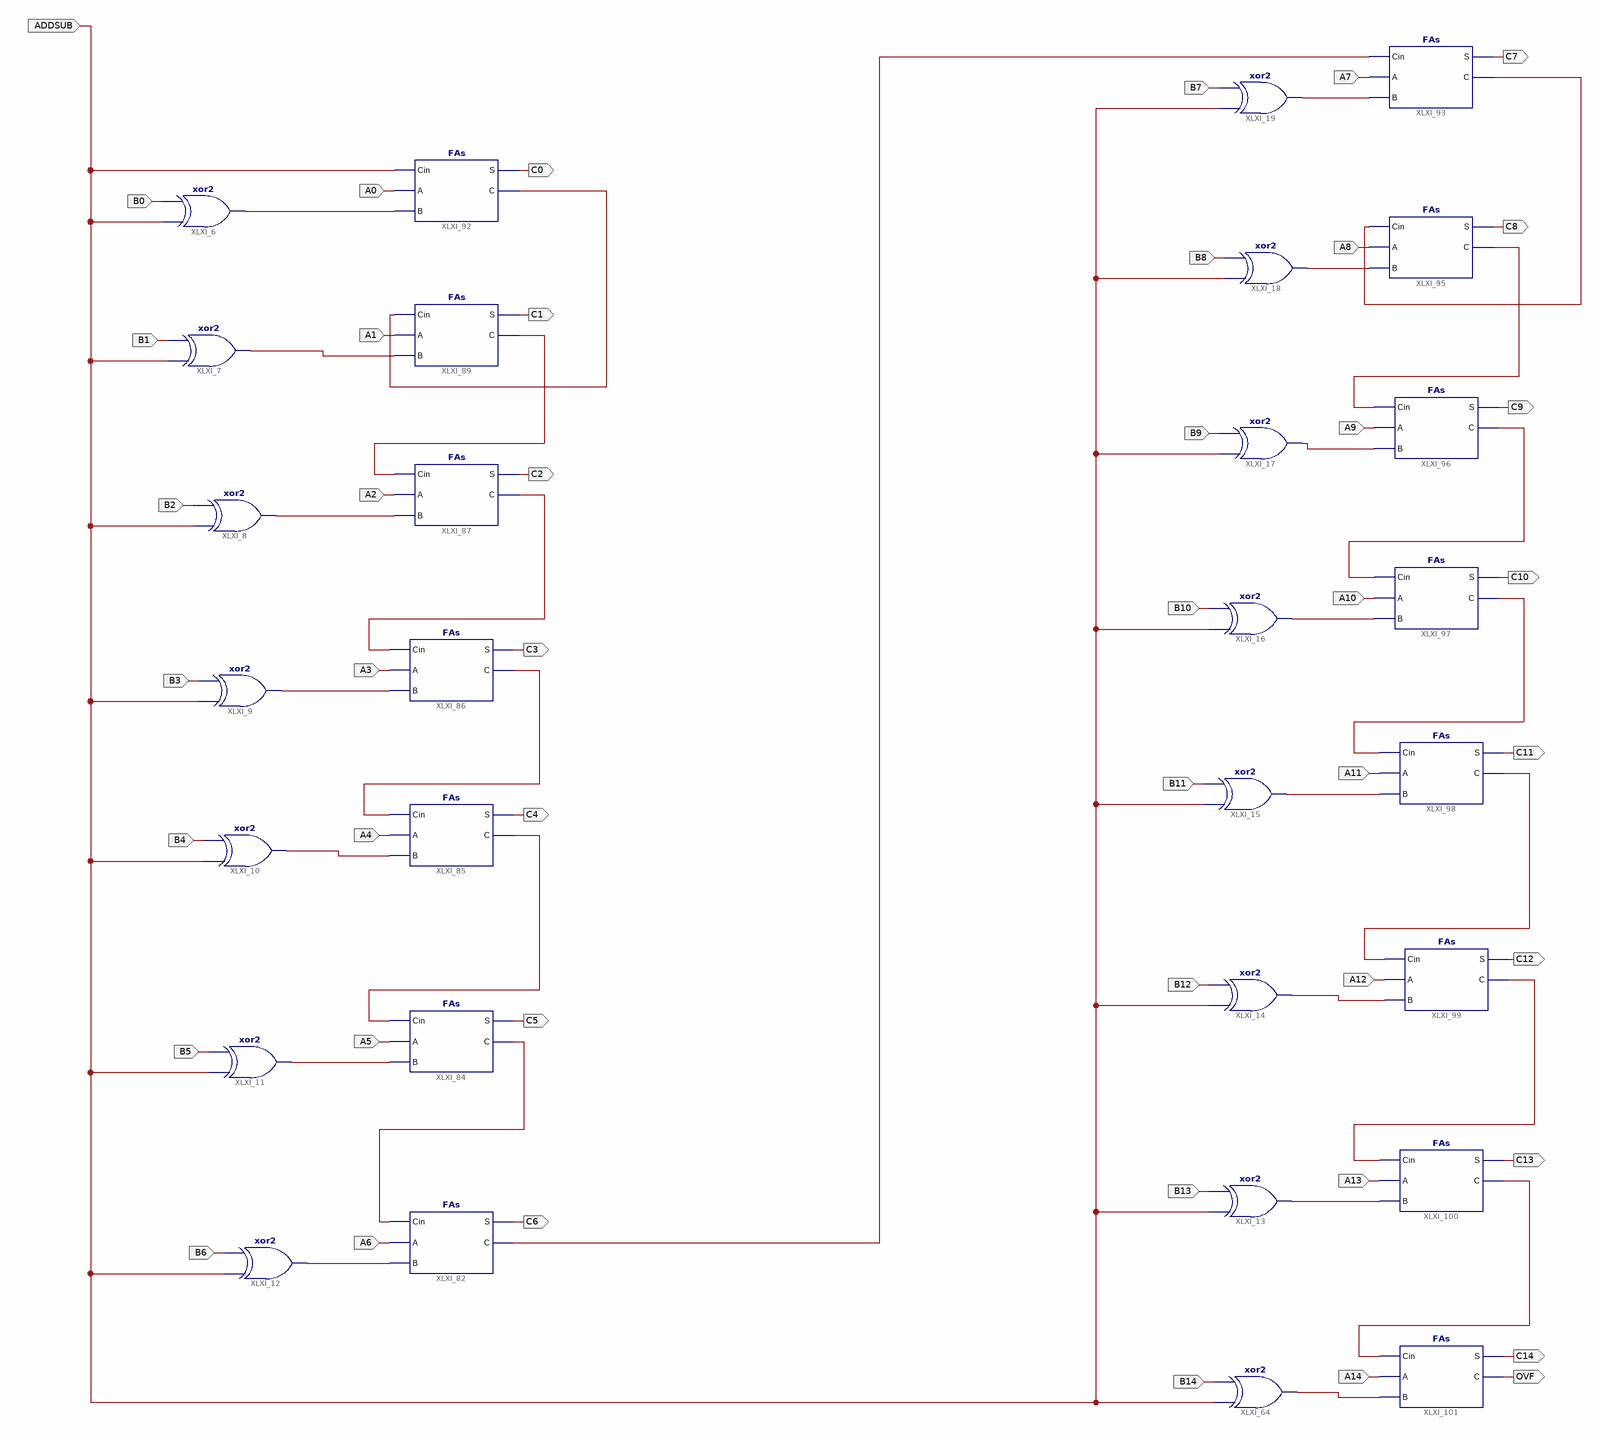
[diagram p0: schematic sheet 1]
// Xilinx ISE schematic asdasd.sch (spartan3e) as structural Verilog: 30 symbols, 47 ports
module asdasd (
  input  B0,
  input  A0,
  input  A2,
  input  B2,
  input  B3,
  input  A3,
  input  B4,
  input  A4,
  input  B5,
  input  A5,
  input  A6,
  input  B6,
  input  B1,
  input  A1,
  input  B7,
  input  A7,
  input  A8,
  input  B8,
  input  A9,
  input  B9,
  input  A10,
  input  B10,
  input  A11,
  input  B11,
  input  A12,
  input  B12,
  input  A13,
  input  B13,
  input  B14,
  input  ADDSUB,
  input  A14,
  output C6,
  output C5,
  output C4,
  output C3,
  output C2,
  output C1,
  output C0,
  output C7,
  output C8,
  output C9,
  output C10,
  output C11,
  output C12,
  output C13,
  output C14,
  output OVF
);

  wire XLXN_1, XLXN_2, XLXN_3, XLXN_5, XLXN_6, XLXN_8, XLXN_9, XLXN_10, XLXN_11, XLXN_12, XLXN_13, XLXN_14,
       XLXN_15, XLXN_17, XLXN_24, XLXN_30, XLXN_64, XLXN_66, XLXN_68, XLXN_70, XLXN_81, XLXN_83, XLXN_85,
       XLXN_89, XLXN_91, XLXN_93, XLXN_96, XLXN_98, XLXN_101;

  xor XLXI_6 (XLXN_1, ADDSUB, B0);
  xor XLXI_7 (XLXN_2, ADDSUB, B1);
  xor XLXI_8 (XLXN_3, ADDSUB, B2);
  xor XLXI_9 (XLXN_14, ADDSUB, B3);
  xor XLXI_10 (XLXN_5, ADDSUB, B4);
  xor XLXI_11 (XLXN_6, ADDSUB, B5);
  xor XLXI_12 (XLXN_17, ADDSUB, B6);
  xor XLXI_13 (XLXN_9, ADDSUB, B13);
  xor XLXI_14 (XLXN_10, ADDSUB, B12);
  xor XLXI_15 (XLXN_11, ADDSUB, B11);
  xor XLXI_16 (XLXN_12, ADDSUB, B10);
  xor XLXI_17 (XLXN_13, ADDSUB, B9);
  xor XLXI_18 (XLXN_24, ADDSUB, B8);
  xor XLXI_19 (XLXN_15, ADDSUB, B7);
  xor XLXI_64 (XLXN_8, ADDSUB, B14);
  FAs XLXI_82 (.A(A6), .B(XLXN_17), .C(XLXN_83), .Cin(XLXN_30), .S(C6));
  FAs XLXI_84 (.A(A5), .B(XLXN_6), .C(XLXN_30), .Cin(XLXN_81), .S(C5));
  FAs XLXI_85 (.A(A4), .B(XLXN_5), .C(XLXN_81), .Cin(XLXN_70), .S(C4));
  FAs XLXI_86 (.A(A3), .B(XLXN_14), .C(XLXN_70), .Cin(XLXN_68), .S(C3));
  FAs XLXI_87 (.A(A2), .B(XLXN_3), .C(XLXN_68), .Cin(XLXN_66), .S(C2));
  FAs XLXI_89 (.A(A1), .B(XLXN_2), .C(XLXN_66), .Cin(XLXN_64), .S(C1));
  FAs XLXI_92 (.A(A0), .B(XLXN_1), .C(XLXN_64), .Cin(ADDSUB), .S(C0));
  FAs XLXI_93 (.A(A7), .B(XLXN_15), .C(XLXN_85), .Cin(XLXN_83), .S(C7));
  FAs XLXI_95 (.A(A8), .B(XLXN_24), .C(XLXN_89), .Cin(XLXN_85), .S(C8));
  FAs XLXI_96 (.A(A9), .B(XLXN_13), .C(XLXN_91), .Cin(XLXN_89), .S(C9));
  FAs XLXI_97 (.A(A10), .B(XLXN_12), .C(XLXN_93), .Cin(XLXN_91), .S(C10));
  FAs XLXI_98 (.A(A11), .B(XLXN_11), .C(XLXN_96), .Cin(XLXN_93), .S(C11));
  FAs XLXI_99 (.A(A12), .B(XLXN_10), .C(XLXN_98), .Cin(XLXN_96), .S(C12));
  FAs XLXI_100 (.A(A13), .B(XLXN_9), .C(XLXN_101), .Cin(XLXN_98), .S(C13));
  FAs XLXI_101 (.A(A14), .B(XLXN_8), .C(OVF), .Cin(XLXN_101), .S(C14));
endmodule
